# Altium project Minibot_V1.PrjPcb
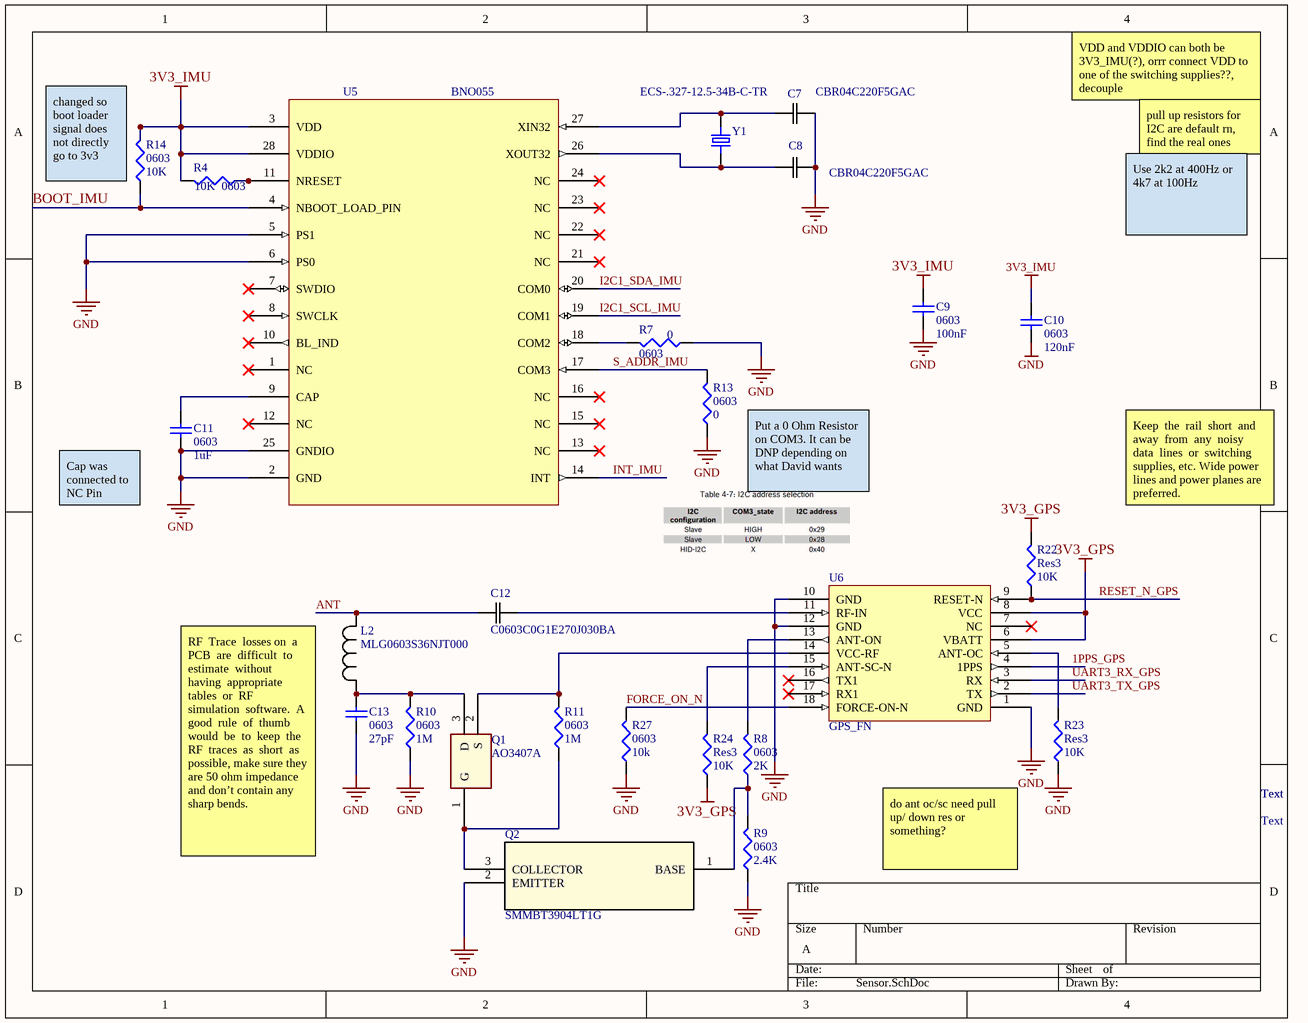
[diagram p0: Sensor.SchDoc]
3 sheets, 48 parts. Net scope: global (net labels, ports and power ports of the same name join across sheets).
Board file: minibot_v1.PcbDoc
Sheets:
  Sensor.SchDoc
  Power.SchDoc
  Nucleo.SchDoc

## Sheet Sensor.SchDoc
size A; SheetNumber: 4; SheetTotal: 6

### Parts
C7  CBR04C220F5GAC  [CAPC10555_55N_KEM]
C8  CBR04C220F5GAC  [CAPC10555_55N_KEM]
C9  0603  value 100nF  [1608[0603]]
C10  0603  value 120nF  [1608[0603]]
C11  0603  value 1uF  [1608[0603]]
C12  C0603C0G1E270J030BA  [CAP_0603_TDK]
C13  0603  value 27pF  [1608[0603]]
L2  MLG0603S36NJT000  [IND_0603_TDK]
Q1  AO3407A  [SOT-23-3L_AOS]
Q2  SMMBT3904LT1G  [SOT-23-3_1P4X3P040_ONS]
R4  0603  value 10K  [J1-0603]
R7  0603  value 0  [J1-0603]
R8  0603  value 2K  [J1-0603]
R9  0603  value 2.4K  [J1-0603]
R10  0603  value 1M  [J1-0603]
R11  0603  value 1M  [J1-0603]
R13  0603  value 0  [J1-0603]
R14  0603  value 10K  [J1-0603]
R22  Res3  value 10K  [J1-0603]
R23  Res3  value 10K  [J1-0603]
R24  Res3  value 10K  [J1-0603]
R27  0603  value 10k  [J1-0603]
U5  BNO055  [QFN_BNO055_BOS]
U6  GPS_FN  [SL871]
Y1  ECS-.327-12.5-34B-C-TR  [XTAL_ECS-.327-12.5-34B-C-TR]

### Nets
3V3_GPS: R22.2 R24.1 U6.6(VBATT) U6.8(VCC)
3V3_IMU: C9.2 C10.2 R4.2 R14.2 U5.3(VDD) U5.28(VDDIO)
GND: C7.2 C8.2 C9.1 C10.1 C11.1 C13.1 Q2.2(EMITTER) R7.1 R9.1 R10.1 R13.1 R23.1 R27.1 U5.2(GND) U5.5(PS1) U5.6(PS0) U5.25(GNDIO) U6.1(GND) U6.10(GND) U6.12(GND)
1PPS_GPS: U6.4(1PPS)
ANT: C12.1 L2.1
BOOT_IMU: R14.1 U5.4(NBOOT_LOAD_PIN)
FORCE_ON_N: R27.2 U6.18(FORCE-ON-N)
I2C1_SCL_IMU: U5.19(COM1)
I2C1_SDA_IMU: U5.20(COM0)
INT_IMU: U5.14(INT)
RESET_N_GPS: R22.1 U6.9(RESET-N)
S_ADDR_IMU: R13.2 U5.17(COM3)
UART3_RX_GPS: U6.3(RX)
UART3_TX_GPS: U6.2(TX)
NetC7_1: C7.1 U5.27(XIN32) Y1.2
NetC8_1: C8.1 U5.26(XOUT32) Y1.1
NetC11_2: C11.2 U5.9(CAP)
NetC12_2: C12.2 U6.11(RF-IN)
NetC13_2: C13.2 L2.2 Q1.3(D) R10.2
NetQ1_1: Q1.1(G) Q2.3(COLLECTOR) R11.1
NetQ1_2: Q1.2(S) R11.2 U6.14(VCC-RF)
NetQ2_1: Q2.1(BASE) R8.1 R9.2
NetR4_1: R4.1 U5.11(NRESET)
NetR7_2: R7.2 U5.18(COM2)
NetR8_2: R8.2 U6.13(ANT-ON)
NetR23_2: R23.2 U6.5(ANT-OC)
NetR24_2: R24.2 U6.15(ANT-SC-N)

Not connected (* = marked no-connect by the designer): U5 1(NC)* 7(SWDIO)* 8(SWCLK)* 10(BL_IND)* 12(NC)* 13(NC)* 15(NC)* 16(NC)* 21(NC)* 22(NC)* 23(NC)* 24(NC)*; U6 7(NC)* 16(TX1)* 17(RX1)*

### Notes on the sheet
- VDD and VDDIO can both be 3V3_IMU(?), orrr connect VDD to one of the switching supplies??, decouple
- pull up resistors for I2C are default rn, find the real ones
- (near R14) changed so boot loader signal does not directly go to 3v3
- Use 2k2 at 400Hz or 4k7 at 100Hz
- (near C11) Cap was connected to NC Pin
- (near R13) Put a 0 Ohm Resistor on COM3. It can be DNP depending on what David wants
- Keep  the  rail  short  and  away  from  any  noisy  data  lines  or  switching  supplies, etc. Wide power lines and power planes are preferred.
- Text
- RF  Trace  losses on  a  PCB  are  difficult  to  estimate  without  having  appropriate  tables  or  RF  simulation  software.  A  good  rule  of  thumb  would  be  to  keep  the  RF  traces  as  short  as  possible, make sure they are 50 ohm impedance and don’t contain any sharp bends.
- (near R23) do ant oc/sc need pull up/ down res or something?

### Library data of the parts
C7 C8 = CBR04C220F5GAC: No Description Available; Mfr_Name: Kemet; Type: DEV; Copyright: Copyright (C) 2023 Ultra Librarian. All rights reserved.; Manufacturer_Part_Number: CBR04C220F5GAC; Digi-Key_Part_Number_1: 399-8827-1-ND; Digi-Key_Part_Number_2: 399-8827-2-ND; Digi-Key_Part_Number_3: 399-8827-6-ND; RefDes: RefDes
C9-C11 C13 = Cap Semi: Capacitor (Semiconductor SIM Model); Published: 8-Jun-2000; LatestRevisionDate: 29-May-2009; LatestRevisionNote: IPC-7351 Footprint Added.; PackageReference: C1206; Publisher: Altium Limited; PackageDescription: Chip Capacitor
C12 = C0603C0G1E270J030BA: No Description Available; Mfr_Name: TDK; Type: DEV; Copyright: Copyright (C) 2023 Ultra Librarian. All rights reserved.; Manufacturer_Part_Number: C0603C0G1E270J030BA; Digi-Key_Part_Number_1: 445-4661-1-ND; Digi-Key_Part_Number_2: 445-4661-2-ND; Digi-Key_Part_Number_3: 445-4661-6-ND; RefDes: RefDes
L2 = MLG0603S36NJT000: No Description Available; Mfr_Name: TDK; Type: DEV; Copyright: Copyright (C) 2023 Ultra Librarian. All rights reserved.; Manufacturer_Part_Number: MLG0603S36NJT000; Digi-Key_Part_Number_1: 445-6298-1-ND; Digi-Key_Part_Number_2: 445-6298-2-ND; Digi-Key_Part_Number_3: 445-6298-6-ND; RefDes: RefDes
Q1 = AO3407A: No Description Available; Mfr_Name: Alpha and Omega Semiconductor; Type: DEV; Copyright: Copyright (C) 2023 Ultra Librarian. All rights reserved.; Manufacturer_Part_Number: AO3407A; Digi-Key_Part_Number_1: 785-1006-2-ND; Digi-Key_Part_Number_2: 785-1006-1-ND; Digi-Key_Part_Number_3: 785-1006-6-ND; Digi-Key_Part_Number_4: 785-1006-2-NDL; RefDes: RefDes
Q2 = SMMBT3904LT1G: No Description Available; Mfr_Name: onsemi; Type: DEV; Copyright: Copyright (C) 2023 Ultra Librarian. All rights reserved.; Manufacturer_Part_Number: SMMBT3904LT1G; Digi-Key_Part_Number_1: SMMBT3904LT1GOSTR-ND; Digi-Key_Part_Number_2: SMMBT3904LT1GOSCT-ND; Digi-Key_Part_Number_3: SMMBT3904LT1GOSDKR-ND; RefDes: RefDes
R4 R7-R11 R13 R14 R22-R24 R27 = Res3: Resistor; Published: 8-Jun-2000; LatestRevisionDate: 29-May-2009; LatestRevisionNote: IPC-7351 Footprint Added.; PackageReference: J1-0603; Publisher: Altium Limited; PackageDescription: Chip Resistor
U5 = BNO055: No Description Available; Mfr_Name: Bosch Sensortec; Copyright: Copyright (C) 2023 Ultra Librarian. All rights reserved.; Manufacturer_Part_Number: BNO055; Digi-Key_Part_Number_1: 828-1058-1-ND; Digi-Key_Part_Number_2: 828-1058-2-ND; Digi-Key_Part_Number_3: 828-1058-6-ND; RefDes: RefDes; Type: DEV
Y1 = ECS-.327-12.5-34B-C-TR: 32.768kHz Â±10ppm Crystal 12.5pF 70 kOhms 2-SMD, No Lead; MF: ECS Inc.; Digi-Key_Part_Number: XC1968CT-ND; Package: SMD-2 ECS International; DigiKey-Purchase-URL: https://snapeda.com/shop?store=DigiKey&id=55051; MP: ECS-.327-12.5-34B-C-TR; SnapEDA_Link: https://www.snapeda.com/parts/ECS-.327-12.5-34B-C-TR/ECS%20Inc./view-part/55051/?ref=snap; Value: *

## Sheet Power.SchDoc
size A; SheetNumber: 5; SheetTotal: 6
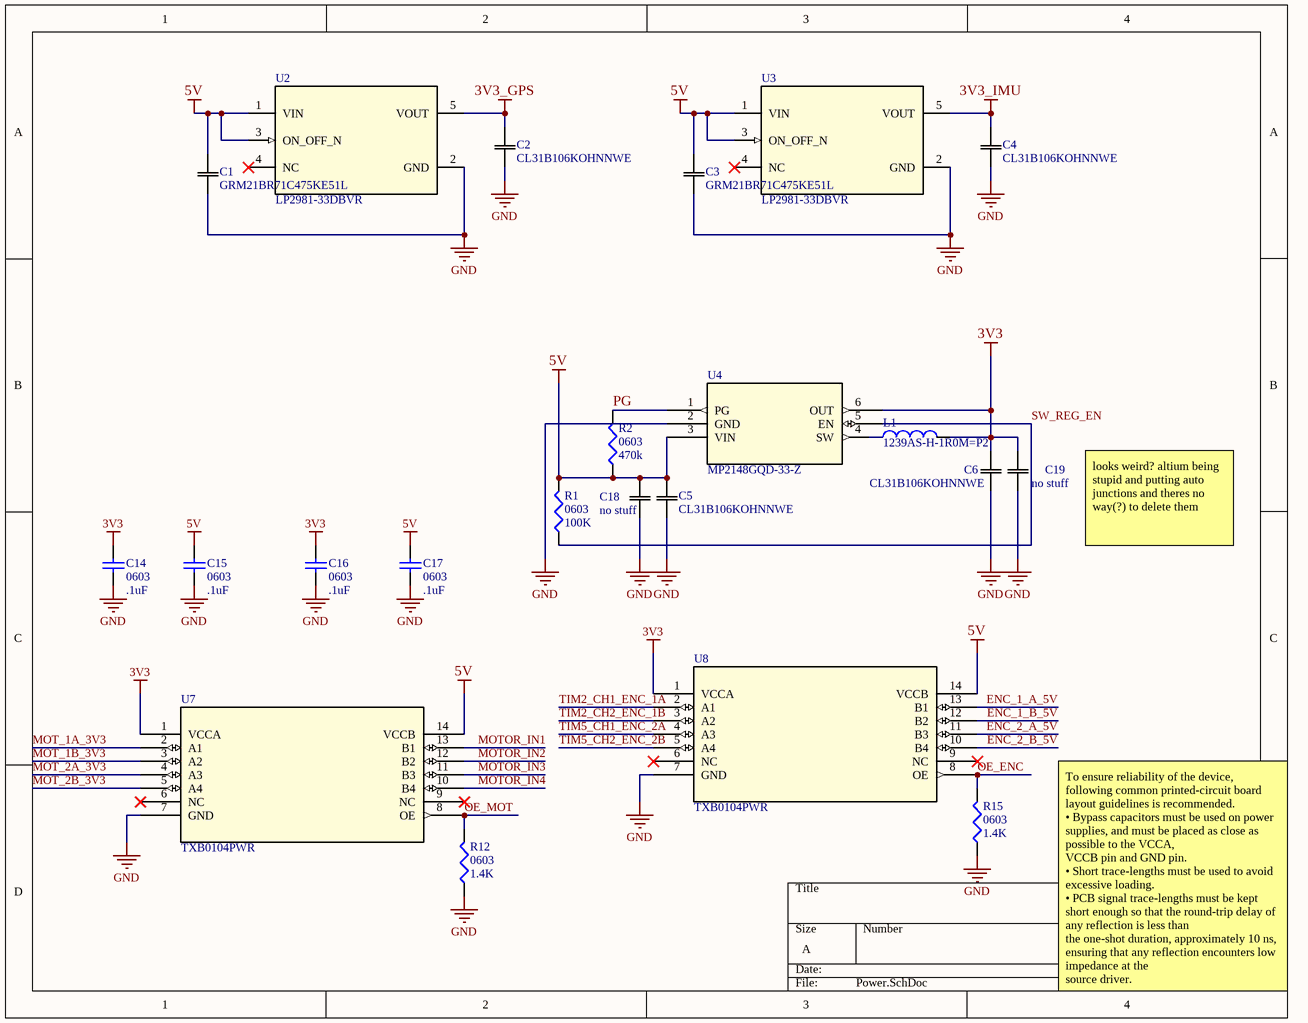
[diagram p1: Power.SchDoc]

### Parts
C1  GRM21BR71C475KE51L  [CAP_GRM0805_2X1P25_MUR]
C2  CL31B106KOHNNWE  [CAP_CL31_SAM]
C3  GRM21BR71C475KE51L  [CAP_GRM0805_2X1P25_MUR]
C4  CL31B106KOHNNWE  [CAP_CL31_SAM]
C5  CL31B106KOHNNWE  [CAP_CL31_SAM]
C6  CL31B106KOHNNWE  [CAP_CL31_SAM]
C14  0603  value .1uF  [1608[0603]]
C15  0603  value .1uF  [1608[0603]]
C16  0603  value .1uF  [1608[0603]]
C17  0603  value .1uF  [1608[0603]]
C18  no stuff  [CAP_CL31_SAM]
C19  no stuff  [CAP_CL31_SAM]
L1  1239AS-H-1R0M=P2  [CAPC10555_55N_KEM]
R1  0603  value 100K  [J1-0603]
R2  0603  value 470k  [J1-0603]
R12  0603  value 1.4K  [J1-0603]
R15  0603  value 1.4K  [J1-0603]
U2  LP2981-33DBVR  [DBV0005A_N]
U3  LP2981-33DBVR  [DBV0005A_N]
U4  MP2148GQD-33-Z  [QFN-1p0x1p5_MNP]
U7  TXB0104PWR  [PW14]
U8  TXB0104PWR  [PW14]

### Nets
3V3: C6.2 C14.2 C16.2 C19.2 L1.2 U4.6(OUT) U7.1(VCCA) U8.1(VCCA)
3V3_GPS: C2.2 U2.5(VOUT)
3V3_IMU: C4.2 U3.5(VOUT)
5V: C1.2 C3.2 C5.2 C15.2 C17.2 C18.2 R1.2 R2.1 U2.1(VIN) U2.3(ON_OFF_N) U3.1(VIN) U3.3(ON_OFF_N) U4.3(VIN) U7.14(VCCB) U8.14(VCCB)
GND: C1.1 C2.1 C3.1 C4.1 C5.1 C6.1 C14.1 C15.1 C16.1 C17.1 C18.1 C19.1 R12.1 R15.1 U2.2(GND) U3.2(GND) U4.2(GND) U7.7(GND) U8.7(GND)
ENC_1_A_5V: U8.13(B1)
ENC_1_B_5V: U8.12(B2)
ENC_2_A_5V: U8.11(B3)
ENC_2_B_5V: U8.10(B4)
MOT_1A_3V3: U7.2(A1)
MOT_1B_3V3: U7.3(A2)
MOT_2A_3V3: U7.4(A3)
MOT_2B_3V3: U7.5(A4)
MOTOR_IN1: U7.13(B1)
MOTOR_IN2: U7.12(B2)
MOTOR_IN3: U7.11(B3)
MOTOR_IN4: U7.10(B4)
OE_ENC: R15.2 U8.8(OE)
OE_MOT: R12.2 U7.8(OE)
PG: R2.2 U4.1(PG)
SW_REG_EN: R1.1 U4.5(EN)
TIM2_CH1_ENC_1A: U8.2(A1)
TIM2_CH2_ENC_1B: U8.3(A2)
TIM5_CH1_ENC_2A: U8.4(A3)
TIM5_CH2_ENC_2B: U8.5(A4)
NetL1_1: L1.1 U4.4(SW)

Not connected (* = marked no-connect by the designer): U2 4(NC)*; U3 4(NC)*; U7 6(NC)* 9(NC)*; U8 6(NC)* 9(NC)*

### Notes on the sheet
- looks weird? altium being stupid and putting auto junctions and theres no way(?) to delete them
- To ensure reliability of the device, following common printed-circuit board layout guidelines is recommended.
  • Bypass capacitors must be used on power supplies, and must be placed as close as possible to the VCCA,
  VCCB pin and GND pin.
  • Short trace-lengths must be used to avoid excessive loading.
  • PCB signal trace-lengths must be kept short enough so that the round-trip delay of any reflection is less than
  the one-shot duration, approximately 10 ns, ensuring that any reflection encounters low impedance at the
  source driver.

### Library data of the parts
C1 C3 = GRM21BR71C475KE51L: No Description Available; Mfr_Name: Murata; Type: DEV; Copyright: Copyright (C) 2023 Ultra Librarian. All rights reserved.; Manufacturer_Part_Number: GRM21BR71C475KE51L; Digi-Key_Part_Number_1: 490-14466-2-ND; Digi-Key_Part_Number_2: 490-14466-1-ND; Digi-Key_Part_Number_3: 490-14466-6-ND; RefDes: RefDes
C2 C4-C6 C18 C19 = CL31B106KOHNNWE: No Description Available; Mfr_Name: Samsung; Type: DEV; Copyright: Copyright (C) 2023 Ultra Librarian. All rights reserved.; Manufacturer_Part_Number: CL31B106KOHNNWE; Digi-Key_Part_Number_1: 1276-3105-2-ND; Digi-Key_Part_Number_2: 1276-3105-1-ND; Digi-Key_Part_Number_3: 1276-3105-6-ND; RefDes: RefDes
C14-C17 = Cap Semi: Capacitor (Semiconductor SIM Model); Published: 8-Jun-2000; LatestRevisionDate: 29-May-2009; LatestRevisionNote: IPC-7351 Footprint Added.; PackageReference: C1206; Publisher: Altium Limited; PackageDescription: Chip Capacitor
L1 = 1239AS-H-1R0M=P2: Inductor with Inductance: 1uH Tol. +/-20%, Package: 1008 _2520_; MF: Murata Electronics; SnapEDA_Link: https://www.snapeda.com/parts/1239AS-H-1R0M%3DP2/Murata%20Electronics%20North%20America/view-part/581165/?ref=snap; Digi-Key_Part_Number: 490-10564-1-ND; Value: *; Digi-Key_Purchase_URL: https://www.digikey.com.au/product-detail/en/murata-electronics/1239AS-H-1R0M=P2/490-10564-1-ND/5272022?utm_source=snapeda&utm_medium=aggregator&utm_campaign=symbol; MP: 1239AS-H-1R0M=P2; Package: 2520 Murata
R1 R2 R12 R15 = Res3: Resistor; Published: 8-Jun-2000; LatestRevisionDate: 29-May-2009; LatestRevisionNote: IPC-7351 Footprint Added.; PackageReference: J1-0603; Publisher: Altium Limited; PackageDescription: Chip Resistor
U2 U3 = LP2981-33DBVR: No Description Available; Mfr_Name: Texas Instruments; Type: DEV; RefDes: RefDes; Copyright: Copyright (C) 2023 Ultra Librarian. All rights reserved.; Manufacturer_Part_Number: LP2981-33DBVR; Digi-Key_Part_Number_1: 296-17360-1-ND; Digi-Key_Part_Number_2: 296-17360-2-ND; Digi-Key_Part_Number_3: 296-17360-6-ND; Digi-Key_Part_Number_4: 2156-LP2981-33DBVR-ND
U4 = MP2148GQD-33-Z: No Description Available; Mfr_Name: Monolithic Power Systems; Copyright: Copyright (C) 2023 Ultra Librarian. All rights reserved.; Manufacturer_Part_Number: MP2148GQD-33-Z; Digi-Key_Part_Number_1: MP2148GQD-33-Z-ND; RefDes: RefDes; Type: DEV
U7 U8 = TXB0104PWR: No Description Available; Mfr_Name: Texas Instruments; Copyright: Copyright (C) 2023 Ultra Librarian. All rights reserved.; Manufacturer_Part_Number: TXB0104PWR; Digi-Key_Part_Number_1: 296-21929-1-ND; Digi-Key_Part_Number_2: 296-21929-2-ND; Digi-Key_Part_Number_3: 296-21929-6-ND; RefDes: RefDes; Type: DEV

## Sheet Nucleo.SchDoc
size A; SheetNumber: 6; SheetTotal: 5
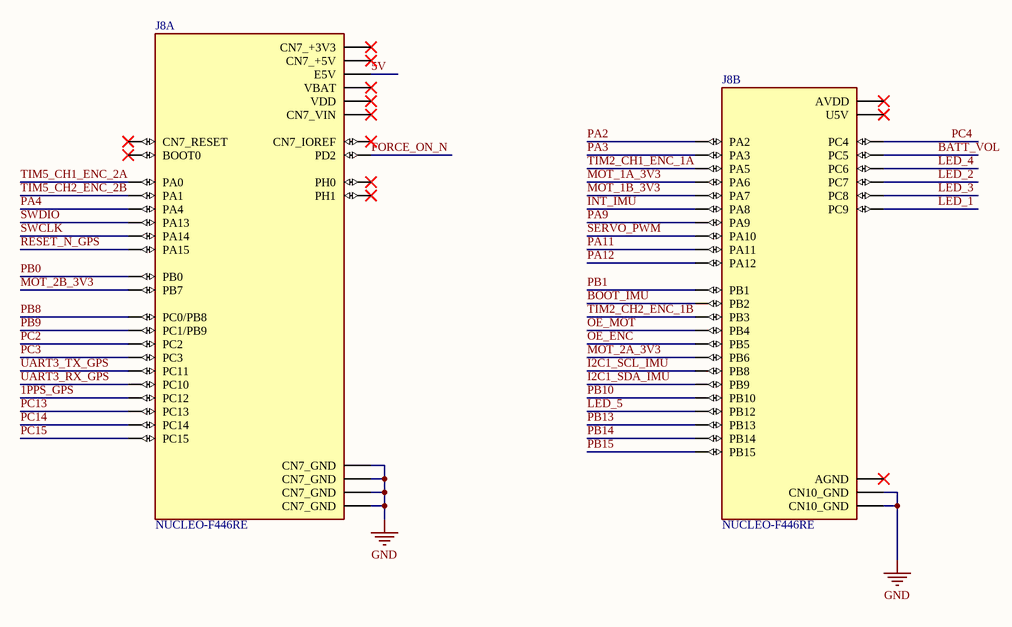
[diagram p2: Nucleo.SchDoc]

### Parts
J8  NUCLEO-F446RE  [MODULE_NUCLEO-F446RE]  (parts A,B of 6)

### Nets
5V: J8.CN7_6(E5V)
GND: J8.CN7_8(CN7_GND) J8.CN7_19(CN7_GND) J8.CN7_20(CN7_GND) J8.CN7_22(CN7_GND) J8.CN10_9(CN10_GND) J8.CN10_20(CN10_GND)
1PPS_GPS: J8.CN7_3(PC12)
BATT_VOL: J8.CN10_6(PC5)
BOOT_IMU: J8.CN10_22(PB2)
FORCE_ON_N: J8.CN7_4(PD2)
I2C1_SCL_IMU: J8.CN10_3(PB8)
I2C1_SDA_IMU: J8.CN10_5(PB9)
INT_IMU: J8.CN10_23(PA8)
LED_1: J8.CN10_1(PC9)
LED_2: J8.CN10_19(PC7)
LED_3: J8.CN10_2(PC8)
LED_4: J8.CN10_4(PC6)
LED_5: J8.CN10_16(PB12)
MOT_1A_3V3: J8.CN10_13(PA6)
MOT_1B_3V3: J8.CN10_15(PA7)
MOT_2A_3V3: J8.CN10_17(PB6)
MOT_2B_3V3: J8.CN7_21(PB7)
OE_ENC: J8.CN10_29(PB5)
OE_MOT: J8.CN10_27(PB4)
PA2: J8.CN10_35(PA2)
PA3: J8.CN10_37(PA3)
PA4: J8.CN7_32(PA4)
PA9: J8.CN10_21(PA9)
PA11: J8.CN10_14(PA11)
PA12: J8.CN10_12(PA12)
PB0: J8.CN7_34(PB0)
PB1: J8.CN10_24(PB1)
PB8: J8.CN7_38(PC0/PB8)
PB9: J8.CN7_36(PC1/PB9)
PB10: J8.CN10_25(PB10)
PB13: J8.CN10_30(PB13)
PB14: J8.CN10_28(PB14)
PB15: J8.CN10_26(PB15)
PC2: J8.CN7_35(PC2)
PC3: J8.CN7_37(PC3)
PC4: J8.CN10_34(PC4)
PC13: J8.CN7_23(PC13)
PC14: J8.CN7_25(PC14)
PC15: J8.CN7_27(PC15)
RESET_N_GPS: J8.CN7_17(PA15)
SERVO_PWM: J8.CN10_33(PA10)
SWCLK: J8.CN7_15(PA14)
SWDIO: J8.CN7_13(PA13)
TIM2_CH1_ENC_1A: J8.CN10_11(PA5)
TIM2_CH2_ENC_1B: J8.CN10_31(PB3)
TIM5_CH1_ENC_2A: J8.CN7_28(PA0)
TIM5_CH2_ENC_2B: J8.CN7_30(PA1)
UART3_RX_GPS: J8.CN7_1(PC10)
UART3_TX_GPS: J8.CN7_2(PC11)

Not connected (* = marked no-connect by the designer): J8 CN7_5(VDD)* CN7_7(BOOT0)* CN7_12(CN7_IOREF)* CN7_14(CN7_RESET)* CN7_16(CN7_+3V3)* CN7_18(CN7_+5V)* CN7_24(CN7_VIN)* CN7_29(PH0)* CN7_31(PH1)* CN7_33(VBAT)* CN10_7(AVDD)* CN10_8(U5V)* CN10_32(AGND)*

### Library data of the parts
J8 = NUCLEO-F446RE: STM32 Nucleo-64 development board with STM32F446RET6 MCU, supports Arduino and ST morpho connectivity; Price: None; MP: NUCLEO-F446RE; Availability: Unavailable; Value: *; Package: None

## Nets that join several sheets
3V3_GPS: Sensor (R22.2 R24.1 U6.6 U6.8), Power (C2.2 U2.5)
3V3_IMU: Sensor (6 pins), Power (C4.2 U3.5)
5V: Power (15 pins), Nucleo (J8.CN7_6)
GND: Sensor (20 pins), Power (19 pins), Nucleo (6 pins)
1PPS_GPS: Sensor (U6.4), Nucleo (J8.CN7_3)
BOOT_IMU: Sensor (R14.1 U5.4), Nucleo (J8.CN10_22)
FORCE_ON_N: Sensor (R27.2 U6.18), Nucleo (J8.CN7_4)
I2C1_SCL_IMU: Sensor (U5.19), Nucleo (J8.CN10_3)
I2C1_SDA_IMU: Sensor (U5.20), Nucleo (J8.CN10_5)
INT_IMU: Sensor (U5.14), Nucleo (J8.CN10_23)
MOT_1A_3V3: Power (U7.2), Nucleo (J8.CN10_13)
MOT_1B_3V3: Power (U7.3), Nucleo (J8.CN10_15)
MOT_2A_3V3: Power (U7.4), Nucleo (J8.CN10_17)
MOT_2B_3V3: Power (U7.5), Nucleo (J8.CN7_21)
OE_ENC: Power (R15.2 U8.8), Nucleo (J8.CN10_29)
OE_MOT: Power (R12.2 U7.8), Nucleo (J8.CN10_27)
RESET_N_GPS: Sensor (R22.1 U6.9), Nucleo (J8.CN7_17)
TIM2_CH1_ENC_1A: Power (U8.2), Nucleo (J8.CN10_11)
TIM2_CH2_ENC_1B: Power (U8.3), Nucleo (J8.CN10_31)
TIM5_CH1_ENC_2A: Power (U8.4), Nucleo (J8.CN7_28)
TIM5_CH2_ENC_2B: Power (U8.5), Nucleo (J8.CN7_30)
UART3_RX_GPS: Sensor (U6.3), Nucleo (J8.CN7_1)
UART3_TX_GPS: Sensor (U6.2), Nucleo (J8.CN7_2)